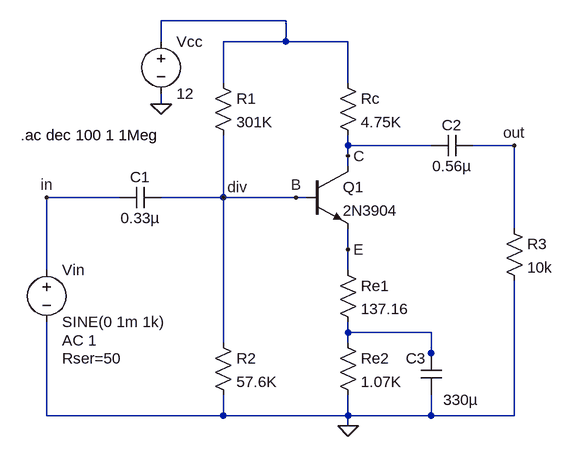
[diagram p0: schematic common_emitter_amplifier.asc]
common_emitter_amplifier.asc, the LTspice schematic file:
Version 4.1
SHEET 1 880 708
WIRE 432 64 240 64
WIRE 240 96 240 64
WIRE 432 96 432 64
WIRE 432 96 336 96
WIRE 528 96 432 96
WIRE 336 160 336 96
WIRE 528 160 528 96
WIRE 240 192 240 176
WIRE 528 256 528 240
WIRE 656 256 528 256
WIRE 784 256 720 256
WIRE 528 272 528 256
WIRE 528 288 528 272
WIRE 176 336 64 336
WIRE 336 336 336 240
WIRE 336 336 240 336
WIRE 448 336 336 336
WIRE 464 336 448 336
WIRE 784 384 784 256
WIRE 528 416 528 384
WIRE 64 448 64 336
WIRE 528 448 528 416
WIRE 528 544 528 528
WIRE 656 544 528 544
WIRE 336 560 336 336
WIRE 528 560 528 544
WIRE 656 576 656 544
WIRE 656 592 656 576
WIRE 64 672 64 528
WIRE 336 672 336 640
WIRE 336 672 64 672
WIRE 528 672 528 640
WIRE 528 672 336 672
WIRE 656 672 656 640
WIRE 656 672 528 672
WIRE 784 672 784 464
WIRE 784 672 656 672
WIRE 528 688 528 672
FLAG 240 192 0
FLAG 336 336 div
FLAG 528 272 C
FLAG 448 336 B
FLAG 528 416 E
FLAG 528 688 0
FLAG 784 256 out
FLAG 64 336 in
DATAFLAG 640 544 ""
SYMBOL voltage 240 80 R0
WINDOW 123 0 0 Left 0
WINDOW 39 0 0 Left 0
SYMATTR InstName Vcc
SYMATTR Value 12
SYMBOL res 320 144 R0
SYMATTR InstName R1
SYMATTR Value 301K
SYMATTR SpiceLine tol=1 pwr=0.1
SYMBOL res 320 544 R0
SYMATTR InstName R2
SYMATTR Value 57.6K
SYMATTR SpiceLine tol=1 pwr=0.1
SYMBOL res 512 144 R0
SYMATTR InstName Rc
SYMATTR Value 4.75K
SYMATTR SpiceLine tol=1 pwr=0.1
SYMBOL res 512 544 R0
SYMATTR InstName Re2
SYMATTR Value 1.07K
SYMATTR SpiceLine tol=1 pwr=0.1
SYMBOL npn 464 288 R0
SYMATTR InstName Q1
SYMATTR Value 2N3904
SYMBOL cap 240 320 R90
WINDOW 0 0 32 VBottom 2
WINDOW 3 32 32 VTop 2
SYMATTR InstName C1
SYMATTR Value 0.33µ
SYMATTR SpiceLine V=6.3 Irms=961m Rser=0.0804392 Lser=0 mfg="KEMET" pn="C1206F334K9RAC" type="X7R"
SYMBOL cap 720 240 R90
WINDOW 0 0 32 VBottom 2
WINDOW 3 32 32 VTop 2
SYMATTR InstName C2
SYMATTR Value 0.56µ
SYMATTR SpiceLine V=6.3 Irms=4.35 Rser=0.0259122 Lser=0 mfg="KEMET" pn="C1210C564K9RAC" type="X7R"
SYMBOL cap 672 640 R180
WINDOW 0 24 56 Left 2
WINDOW 3 -57 -8 Left 2
SYMATTR InstName C3
SYMATTR Value 330µ
SYMATTR Description Capacitor
SYMATTR Type cap
SYMATTR SpiceLine V=2 Irms=3 Rser=0.015 Lser=0 mfg="Panasonic" pn="EEFUD0D331R" type="Al electrolytic"
SYMBOL res 768 368 R0
SYMATTR InstName R3
SYMATTR Value 10k
SYMBOL voltage 64 432 R0
WINDOW 123 24 124 Left 2
WINDOW 39 24 152 Left 2
SYMATTR InstName Vin
SYMATTR Value SINE(0 1m 1k)
SYMATTR Value2 AC 1
SYMATTR SpiceLine Rser=50
SYMBOL res 512 432 R0
SYMATTR InstName Re1
SYMATTR Value 137.16
TEXT 24 240 Left 2 !.ac dec 100 1 1Meg

The netlist it stands for:
* common_emitter_amplifier.asc
Vcc N001 0 12
R1 N001 B 301K tol=1 pwr=0.1
R2 B 0 57.6K tol=1 pwr=0.1
Rc N001 C 4.75K tol=1 pwr=0.1
Re2 N002 0 1.07K tol=1 pwr=0.1
Q1 C B E 0 2N3904
C1 B in 0.33µ V=6.3 Irms=961m Rser=0.0804392 Lser=0 mfg="KEMET" pn="C1206F334K9RAC" type="X7R"
C2 out C 0.56µ V=6.3 Irms=4.35 Rser=0.0259122 Lser=0 mfg="KEMET" pn="C1210C564K9RAC" type="X7R"
C3 0 N002 330µ V=2 Irms=3 Rser=0.015 Lser=0 mfg="Panasonic" pn="EEFUD0D331R" type="Al electrolytic"
R3 out 0 10k
Vin in 0 SINE(0 1m 1k) AC 1 Rser=50
Re1 E N002 137.16
.model NPN NPN
.model PNP PNP
.lib standard.bjt
.ac dec 100 1 1Meg
.backanno
.end